# Altium schematic sheet BLE_ESP32-WROOM-32.SchDoc
size A4; SheetNumber: 5; SheetTotal: 9
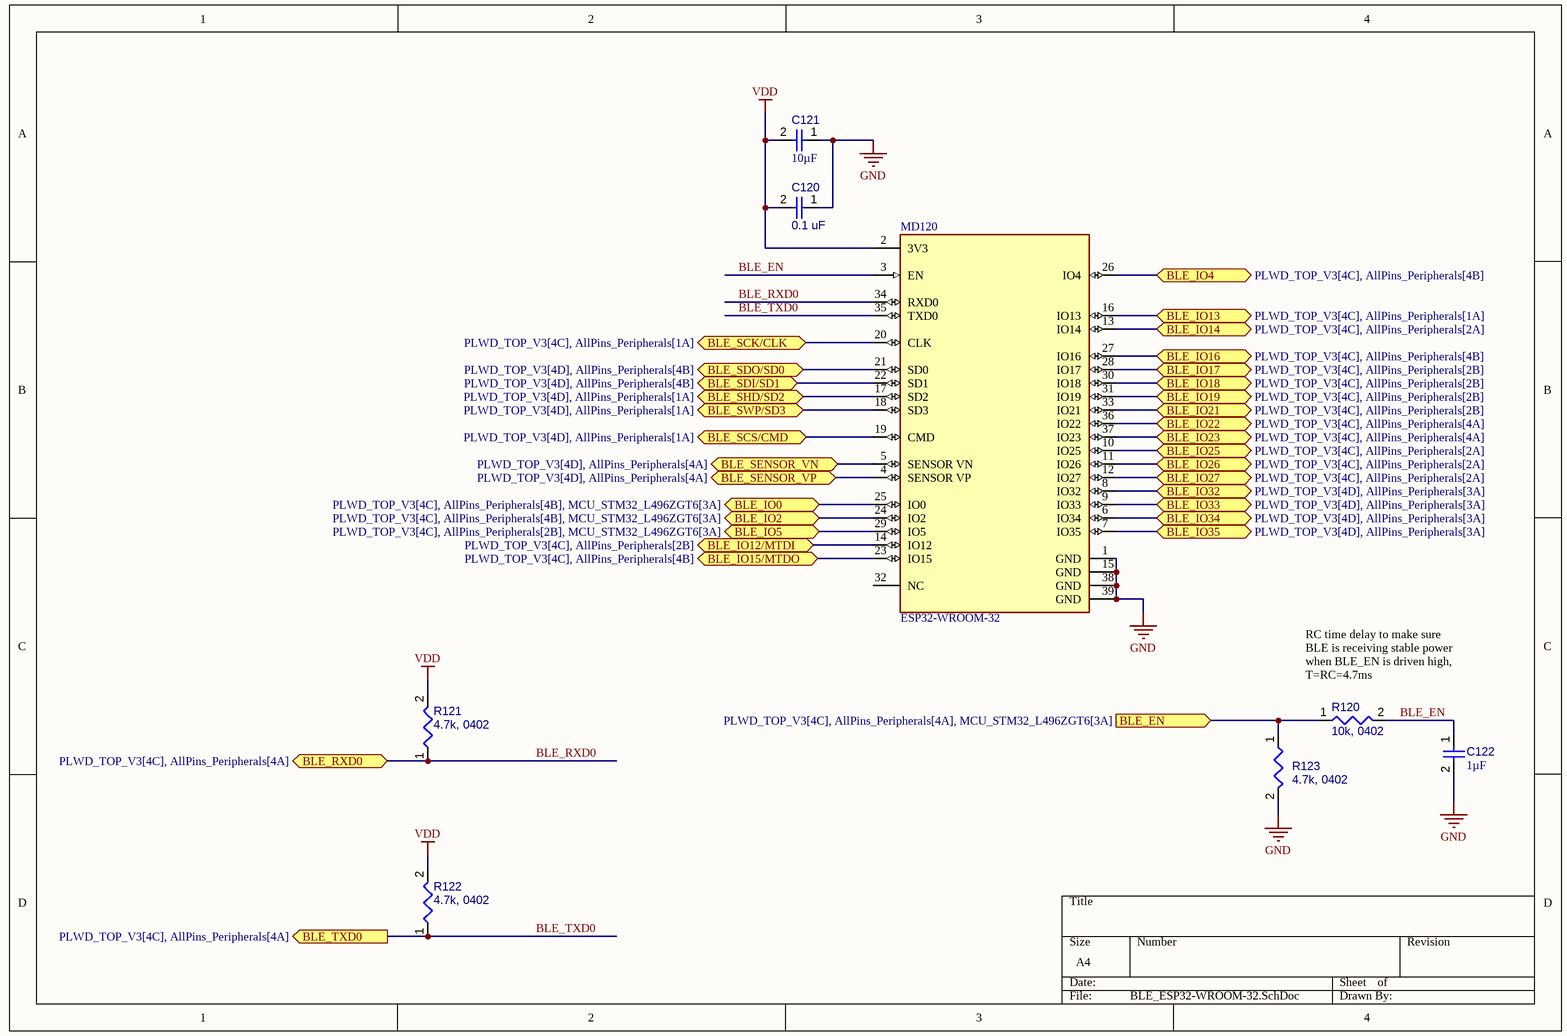
[diagram p0: BLE_ESP32-WROOM-32.SchDoc]

## Parts
C120  0.1 uF  [CAPC1005X56X25LL10T15]
C121  value 10µF  [CAPC0603(1608)100_L]  (hidden comment: Capacitor 10µF +/-20% 10V 0603)
C122  value 1µF  [CAPC0402(1005)60_L]  (hidden comment: Capacitor 1µF +/-20% 10V 0402)
MD120  ESP32-WROOM-32  [FP-ESP32-WROOM-32-MFG]
R120  10k, 0402  [RESC1005X40X25ML05T05]
R121  4.7k, 0402  [RESC0402(1005)_L]
R122  4.7k, 0402  [RESC0402(1005)_L]
R123  4.7k, 0402  [RESC0402(1005)_L]

## Ports
BLE_EN (in, see PLWD_TOP_V3[4C], AllPins_Peripherals[4A], MCU_STM32_L496ZGT6[3A]), BLE_IO0 (bidir, see PLWD_TOP_V3[4C], AllPins_Peripherals[4B], MCU_STM32_L496ZGT6[3A]), BLE_IO2 (bidir, see PLWD_TOP_V3[4C], AllPins_Peripherals[4B], MCU_STM32_L496ZGT6[3A]), BLE_IO4 (bidir, see PLWD_TOP_V3[4C], AllPins_Peripherals[4B]), BLE_IO5 (bidir, see PLWD_TOP_V3[4C], AllPins_Peripherals[2B], MCU_STM32_L496ZGT6[3A]), BLE_IO12/MTDI (bidir, see PLWD_TOP_V3[4C], AllPins_Peripherals[2B]), BLE_IO13 (bidir, see PLWD_TOP_V3[4C], AllPins_Peripherals[1A]), BLE_IO14 (bidir, see PLWD_TOP_V3[4C], AllPins_Peripherals[2A]), BLE_IO15/MTDO (bidir, see PLWD_TOP_V3[4C], AllPins_Peripherals[4B]), BLE_IO16 (bidir, see PLWD_TOP_V3[4C], AllPins_Peripherals[4B]), BLE_IO17 (bidir, see PLWD_TOP_V3[4C], AllPins_Peripherals[2B]), BLE_IO18 (bidir, see PLWD_TOP_V3[4C], AllPins_Peripherals[2B]), BLE_IO19 (bidir, see PLWD_TOP_V3[4C], AllPins_Peripherals[2B]), BLE_IO21 (bidir, see PLWD_TOP_V3[4C], AllPins_Peripherals[2B]), BLE_IO22 (bidir, see PLWD_TOP_V3[4C], AllPins_Peripherals[4A]), BLE_IO23 (bidir, see PLWD_TOP_V3[4C], AllPins_Peripherals[4A]), BLE_IO25 (bidir, see PLWD_TOP_V3[4C], AllPins_Peripherals[2A]), BLE_IO26 (bidir, see PLWD_TOP_V3[4C], AllPins_Peripherals[2A]), BLE_IO27 (bidir, see PLWD_TOP_V3[4C], AllPins_Peripherals[2A]), BLE_IO32 (bidir, see PLWD_TOP_V3[4D], AllPins_Peripherals[3A]), BLE_IO33 (bidir, see PLWD_TOP_V3[4D], AllPins_Peripherals[3A]), BLE_IO34 (bidir, see PLWD_TOP_V3[4D], AllPins_Peripherals[3A]), BLE_IO35 (bidir, see PLWD_TOP_V3[4D], AllPins_Peripherals[3A]), BLE_RXD0 (bidir, see PLWD_TOP_V3[4C], AllPins_Peripherals[4A]), BLE_SCK/CLK (bidir, see PLWD_TOP_V3[4C], AllPins_Peripherals[1A]), BLE_SCS/CMD (bidir, see PLWD_TOP_V3[4D], AllPins_Peripherals[1A]), BLE_SDI/SD1 (bidir, see PLWD_TOP_V3[4D], AllPins_Peripherals[4B]), BLE_SDO/SD0 (bidir, see PLWD_TOP_V3[4D], AllPins_Peripherals[4B]), BLE_SENSOR_VN (bidir, see PLWD_TOP_V3[4D], AllPins_Peripherals[4A]), BLE_SENSOR_VP (bidir, see PLWD_TOP_V3[4D], AllPins_Peripherals[4A]), BLE_SHD/SD2 (bidir, see PLWD_TOP_V3[4D], AllPins_Peripherals[1A]), BLE_SWP/SD3 (bidir, see PLWD_TOP_V3[4D], AllPins_Peripherals[1A]), BLE_TXD0 (out, see PLWD_TOP_V3[4C], AllPins_Peripherals[4A])

## Nets
GND: C120.1 C121.1 C122.2 MD120.1(GND) MD120.15(GND) MD120.38(GND) MD120.39(GND) R123.2
VDD: C120.2 C121.2 MD120.2(3V3) R121.2 R122.2
BLE_EN: C122.1 MD120.3(EN) R120.2
BLE_EN: R120.1 R123.1 ; port BLE_EN  [a separate net that carries the same name]
BLE_IO0: MD120.25(IO0) ; port BLE_IO0
BLE_IO2: MD120.24(IO2) ; port BLE_IO2
BLE_IO4: MD120.26(IO4) ; port BLE_IO4
BLE_IO5: MD120.29(IO5) ; port BLE_IO5
BLE_IO12/MTDI: MD120.14(IO12) ; port BLE_IO12/MTDI
BLE_IO13: MD120.16(IO13) ; port BLE_IO13
BLE_IO14: MD120.13(IO14) ; port BLE_IO14
BLE_IO15/MTDO: MD120.23(IO15) ; port BLE_IO15/MTDO
BLE_IO16: MD120.27(IO16) ; port BLE_IO16
BLE_IO17: MD120.28(IO17) ; port BLE_IO17
BLE_IO18: MD120.30(IO18) ; port BLE_IO18
BLE_IO19: MD120.31(IO19) ; port BLE_IO19
BLE_IO21: MD120.33(IO21) ; port BLE_IO21
BLE_IO22: MD120.36(IO22) ; port BLE_IO22
BLE_IO23: MD120.37(IO23) ; port BLE_IO23
BLE_IO25: MD120.10(IO25) ; port BLE_IO25
BLE_IO26: MD120.11(IO26) ; port BLE_IO26
BLE_IO27: MD120.12(IO27) ; port BLE_IO27
BLE_IO32: MD120.8(IO32) ; port BLE_IO32
BLE_IO33: MD120.9(IO33) ; port BLE_IO33
BLE_IO34: MD120.6(IO34) ; port BLE_IO34
BLE_IO35: MD120.7(IO35) ; port BLE_IO35
BLE_RXD0: MD120.34(RXD0) R121.1 ; port BLE_RXD0
BLE_SCK/CLK: MD120.20(CLK) ; port BLE_SCK/CLK
BLE_SCS/CMD: MD120.19(CMD) ; port BLE_SCS/CMD
BLE_SDI/SD1: MD120.22(SD1) ; port BLE_SDI/SD1
BLE_SDO/SD0: MD120.21(SD0) ; port BLE_SDO/SD0
BLE_SENSOR_VN: MD120.5(SENSOR_VN) ; port BLE_SENSOR_VN
BLE_SENSOR_VP: MD120.4(SENSOR_VP) ; port BLE_SENSOR_VP
BLE_SHD/SD2: MD120.17(SD2) ; port BLE_SHD/SD2
BLE_SWP/SD3: MD120.18(SD3) ; port BLE_SWP/SD3
BLE_TXD0: MD120.35(TXD0) R122.1 ; port BLE_TXD0

Not connected (* = marked no-connect by the designer): MD120 32(NC)

## Notes on the sheet
- (near R120) RC time delay to make sure BLE is receiving stable power when BLE_EN is driven high, T=RC=4.7ms

## Library data of the parts
C120 = CMP-001-00001-6: Chip Capacitor, 0.1 uF, +/- 5%, 16 V, 0402 (1005 Metric); Value: 100nF; Capacitor Type: Ceramic; Voltage Rating: 16V; Min Operating Temperature: -55°C; Pins: 2; Case/Package: 0402; Max Operating Temperature: 125°C; Mounting Technology: SM; RoHS Compliant: True; Tolerance: 5%
C121 = CMP-001-00075-4: Chip Capacitor, 10µF +/-20%, 10V, 0603, Thickness 1 mm; Tolerance: 10%; Voltage Rating: 10V; Max Operating Temperature: 85°C; Pins: 2; Case/Package: 0603; Mounting Technology: SMT; Min Operating Temperature: -55°C
C122 = CMP-001-00063-3: Chip Capacitor, 1µF +/-20%, 10V, 0402, Thickness 0.6 mm; Tolerance: 10%; Mounting Technology: SMT; Max Operating Temperature: 85°C; Voltage Rating: 10V; Pins: 2; Case/Package: 0402; Min Operating Temperature: -55°C
MD120 = CMP-194065-000008-1: RX TXRX MOD WIFI SURFACE MOUNT; Frequency: 2.5GHz; Sensitivity: -98dBm; Operating Supply Voltage: 3.6V; Data Rate: 150Mbps; Weight: 0.088185oz; Package Quantity: 550; Min Operating Temperature: -40°C; Mount: Surface Mount; Max Operating Temperature: 85°C; Packaging: Cut Tape; Case/Package: SMD/SMT
R120 = CMP-009-00015-5: Chip Resistor, 10 KOhm, +/- 1%, 0.1 W, -55 to 155 degC, 0402 (1005 Metric); Voltage Rating: 50V; Power: 100mW; Case/Package: 0402; Value: 10k; RoHS Compliant: True; Min Operating Temperature: -55°C; Mounting Technology: SM; Tolerance: 1%; Max Operating Temperature: 155°C; Pins: 2
R121-R123 = CMP-009-00158-3: Chip Resistor, 4,7 kOhms, +/-1 %, 63 mW, -55 to 155 degC, 0402; Power: 63mW; Tolerance: 1%; Max Operating Temperature: 155°C; Pins: 2; Value: 4.7k; Min Operating Temperature: -55°C; Case/Package: 0402